# Altium schematic sheet TPS61023_Boost_Converter.SchDoc: TPS61023 Boost Converter
size A4
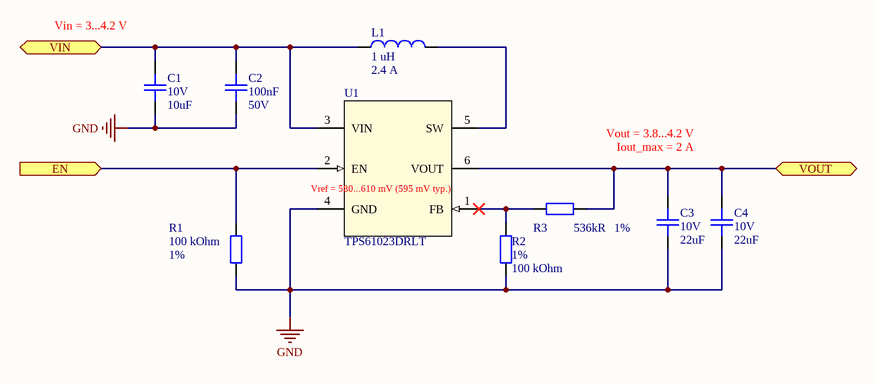
[diagram p0: TPS61023_Boost_Converter.SchDoc]

## Parts
C1  Voltage Rating: 10V  Capacitance: 10uF  [C0805]  (hidden comment: CAP CER 10uF X7R 10% 0805)
C2  Capacitance: 100nF  Voltage: 50V  [C0402]  (hidden comment: CAP CER 0.1UF 50V X7R 0402)
C3  Voltage Rating: 10V  Capacitance: 22uF  [C0805]  (hidden comment: CAP CER 22UF 10V X5R 0805)
C4  Voltage Rating: 10V  Capacitance: 22uF  [C0805]  (hidden comment: CAP CER 22UF 10V X5R 0805)
L1  Inductance: 1 uH  Maximum DC Current: 2.4 A  [IND_WE_LQSH_3012]  (hidden comment: FIXED IND 1UH 2.4A 54 MOHM MAX)
R1  Tolerance: 1%  Resistance: 100 kOhm  [R0402]  (hidden comment: RES SMD 100K OHM 1% 1/16W 0402)
R2  Tolerance: 1%  Resistance: 100 kOhm  [R0402]  (hidden comment: RES SMD 100K OHM 1% 1/16W 0402)
R3  Resistance: 536kR  Tolerance: 1%  [R0402]  (hidden comment: RES SMD 536K OHM 1% 1/16W 0402)
U1  TPS61023DRLT  [SOT50P160X60-6N]

## Ports
EN (in), VIN, VOUT

## Nets
GND: C1.2 C2.2 C3.1 C4.1 R1.1 R2.1 U1.4(GND)
EN: R1.2 U1.2(EN) ; port EN
VIN: C1.1 C2.1 L1.1 U1.3(VIN) ; port VIN
VOUT: C3.2 C4.2 R3.2 U1.6(VOUT) ; port VOUT
NetL1_2: L1.2 U1.5(SW)
NetR2_2: R2.2 R3.1 U1.1(FB)

## Notes on the sheet
- Vin = 3...4.2 V
- (near U1) Vref = 580...610 mV (595 mV typ.)
- Vout = 3.8...4.2 V
- Iout_max = 2 A
- Title
- Size:
- Date:
- A4
- Number:
- Time:
- Revision:
- Sheet
- of
- File:

## Library data of the parts
C1 = CAP CER 10uF X7R 10% 0805: Capacitor,10uF,10V,X7R,10%,0805,Murata; Manufacturer Part Number: GRM21BR71A106KA73L; Supplier 1: Digi-Key; Manufacturer: Murata; Stock 1: 2099435; Pricing 1: 1=0.26, 10=0.176, 100=0.089, 500=0.0609, 1000=0.0538 (USD); Mount: Surface Mount; Case Code (Metric): 2012; Case Code (Imperial): 0805; Min Operating Temperature: -55°C; Max Operating Temperature: 125°C; Packaging: Tape and Reel; Tolerance: 10%; Voltage Rating (DC): 10V; Dielectric: X7R; Termination: SMD/SMT; Package Quantity: 3000; Length: 2mm; Height: 1.25mm; Width: 1.25mm; Thickness: 0.055inch; Depth: 1.25mm; REACH SVHC: No SVHC; ComponentLink1URL: http://components.arrow.com/part/dataview/0323_07281730?src-supplier=Arrow+Europe; ComponentLink1Description: http://components.arrow.com/part/dataview/0323_07281730?src-supplier=Arrow+Europe; ComponentLink2URL: http://www.mouser.com/ds/2/281/c02e-2905.pdf?src-supplier=Mouser; ComponentLink2Description: http://www.mouser.com/ds/2/281/c02e-2905.pdf?src-supplier=Mouser; ComponentLink3URL: http://www.farnell.com/datasheets/2079188.pdf?src-supplier=Newark; ComponentLink3Description: http://www.farnell.com/datasheets/2079188.pdf?src-supplier=Newark; ComponentLink4URL: http://www.farnell.com/datasheets/2079188.pdf?src-supplier=Farnell; ComponentLink4Description: http://www.farnell.com/datasheets/2079188.pdf?src-supplier=Farnell; ComponentLink5URL: http://www.farnell.com/datasheets/2079188.pdf?src-supplier=Element14; ComponentLink5Description: http://www.farnell.com/datasheets/2079188.pdf?src-supplier=Element14; Supplier Part Number 1: 490-10516-1-ND; Case/Package: 0805; Weight: 0.000335oz; ComponentLink6URL: http://search.murata.co.jp/Ceramy/image/img/A01X/G101/ENG/GRM21BR71A106KA73-01.pdf?src-supplier=Digi-Key; ComponentLink6Description: http://search.murata.co.jp/Ceramy/image/img/A01X/G101/ENG/GRM21BR71A106KA73-01.pdf?src-supplier=Digi-Key
C2 = CAP CER 0.1UF 50V X7R 0402: 0.1µF ±10% 50V Ceramic Capacitor X7R 0402 (1005 Metric); Manufacturer: TDK; Manufacturer Part Number: CGA2B3X7R1H104K050BB; Supplier 1: Digi-Key; Stock 1: 2925303; Pricing 1: 1=0.17, 10=0.118, 50=0.0668, 100=0.0553, 500=0.0388, 1000=0.0321, 2500=0.0299, 5000=0.0273 (USD); Mount: Surface Mount; Case Code (Metric): 1005; Case Code (Imperial): 0402; Min Operating Temperature: -55°C; Max Operating Temperature: 125°C; Packaging: Tape and Reel; Tolerance: 10%; Voltage Rating (DC): 50V; Dielectric: X7R; Termination: SMD/SMT; Package Quantity: 1; Length: 1mm; Height: 0.5mm; Width: 0.02inch; Thickness: 0.022inch; Depth: 0.5mm; REACH SVHC: No SVHC; ComponentLink1URL: http://product.tdk.com/capacitor/mlcc/en/documents/mlccspec_automotive_general_midvoltage_en.pdf?src-supplier=Future+Electronics; ComponentLink1Description: http://product.tdk.com/capacitor/mlcc/en/documents/mlccspec_automotive_general_midvoltage_en.pdf?src-supplier=Future+Electronics; ComponentLink2URL: http://www.farnell.com/datasheets/1807242.pdf?src-supplier=Element14; ComponentLink2Description: http://www.farnell.com/datasheets/1807242.pdf?src-supplier=Element14; ComponentLink3URL: http://www.mouser.com/ds/2/400/lcc_automotive_general_en-843974.pdf?src-supplier=Mouser; ComponentLink3Description: http://www.mouser.com/ds/2/400/lcc_automotive_general_en-843974.pdf?src-supplier=Mouser; ComponentLink4URL: http://www.farnell.com/datasheets/1936565.pdf?src-supplier=Element14; ComponentLink4Description: http://www.farnell.com/datasheets/1936565.pdf?src-supplier=Element14; ComponentLink5URL: http://www.farnell.com/datasheets/1735392.pdf?src-supplier=Element14; ComponentLink5Description: http://www.farnell.com/datasheets/1735392.pdf?src-supplier=Element14; Supplier Part Number 1: 445-6899-1-ND; Case/Package: 0402; Voltage Rating: 50V; Weight: 2.3E-05oz; Composition: Ceramic; Ratings: AEC-Q200; Lead Free: Lead Free
C3 C4 = CAP CER 22UF 10V X5R 0805: 22µF ±20% 10V Ceramic Capacitor X5R 0805 (2012 Metric); Manufacturer: Taiyo Yuden; Manufacturer Part Number: LMK212BJ226MG-T; Supplier 1: Digi-Key; Stock 1: 1006805; Pricing 1: 1=0.45, 10=0.312, 100=0.1875, 500=0.1406, 1000=0.1187 (USD); Mount: Surface Mount; Number of Pins: 2; Case Code (Metric): 2012; Case Code (Imperial): 0805; Min Operating Temperature: -55°C; Max Operating Temperature: 85°C; Packaging: Tape and Reel; Tolerance: 20%; Voltage Rating (DC): 10V; Dielectric: X5R; Termination: SMD/SMT; Package Quantity: 1; Composition: Ceramic; Length: 2mm; Height: 1.25mm; Width: 0.049inch; Thickness: 0.053inch; Depth: 1.25mm; Radiation Hardening: No; REACH SVHC: Unknown; ComponentLink1URL: https://www.yuden.co.jp/productdata/catalog/mlcc_all_e.pdf?src-supplier=Onlinecomponents.com; ComponentLink1Description: https://www.yuden.co.jp/productdata/catalog/mlcc_all_e.pdf?src-supplier=Onlinecomponents.com; ComponentLink2URL: https://www.yuden.co.jp/productdata/catalog/mlcc01_e.pdf?src-supplier=Digi-Key; ComponentLink2Description: https://www.yuden.co.jp/productdata/catalog/mlcc01_e.pdf?src-supplier=Digi-Key; ComponentLink3URL: https://www.yuden.co.jp/productdata/catalog/mlcc_all_e.pdf?src-supplier=Mouser; ComponentLink3Description: https://www.yuden.co.jp/productdata/catalog/mlcc_all_e.pdf?src-supplier=Mouser; ComponentLink4URL: http://www.farnell.com/datasheets/1910934.pdf?src-supplier=Element14; ComponentLink4Description: http://www.farnell.com/datasheets/1910934.pdf?src-supplier=Element14; ComponentLink5URL: https://www.yuden.co.jp/productdata/catalog/mlcc_all_e.pdf?src-supplier=Avnet; ComponentLink5Description: https://www.yuden.co.jp/productdata/catalog/mlcc_all_e.pdf?src-supplier=Avnet; Supplier Part Number 1: 587-1958-1-ND; Case/Package: 0805
L1 = FIXED IND 1UH 2.4A 54 MOHM MAX: 1µH Semi-Shielded Wirewound Inductor 2.4A 54mOhm Max Nonstandard; Manufacturer: Wurth Elektronik; Manufacturer Part Number: 74405031010; Maximum DC Resistance: 54 mOhms; Self Resonant Frequency: 66 MHz; Tolerance: 20 %; Saturation Current: 5.4 A; Test Frequency: 1 MHz; Supplier 1: Mouser; RoHS: RoHS Compliant; Category: Fixed Inductors; Stock 1: 2000; Pricing 1: 1=0.730, 10=0.721, 50=0.601, 100=0.457, 1000=0.397, 2000=0.385 (USD); Application: Power; Height: 1.2 mm; Length: 3 mm; Package / Case: 3 mm x 3 mm; Packaging: Cut Tape; Product: Fixed Inductors; Series: WE-LQSH; Shielding: Shielded; Termination Style: SMD/SMT; Width: 3 mm; Brand: Wurth Elektronik; Mounting Style: PCB Mount; Maximum Operating Temperature: + 125 C; Minimum Operating Temperature: - 40 C; Product Type: Fixed Inductors; Standard Pack Qty: 2000; Subcategory: Inductors, Chokes & Coils; Termination: -; RoHS - Mouser: Y; Minimum Order Quantity: 1; Reeling: True; ComponentLink1URL: https://www.mouser.com/datasheet/2/445/74405031010-1720907.pdf; ComponentLink1Description: https://www.mouser.com/datasheet/2/445/74405031010-1720907.pdf; Supplier 2: Digi-Key; Supplier Part Number 1: 710-74405031010; Supplier Part Number 2: 732-10780-1-ND; Mount: Surface Mount
R1 R2 = RES SMD 100K OHM 1% 1/16W 0402: 100 kOhms ±1% 0.063W, 1/16W Chip Resistor 0402 (1005 Metric) Moisture Resistant Thick Film; Manufacturer: Yageo; Manufacturer Part Number: RC0402FR-07100KL; Temperature Coefficient: 100ppm/°C; Power Rating: 63mW; Voltage Rating: 50V; Supplier 1: Digi-Key; Stock 1: 47448883; Pricing 1: 1=0.1, 10=0.016, 100=0.0064, 1000=0.0029, 2500=0.0025, 5000=0.0021 (USD); Case Code (Metric): 1005; Case Code (Imperial): 0402; Min Operating Temperature: -55°C; Max Operating Temperature: 155°C; Composition: Thick Film; Packaging: Tape and Reel; Package Quantity: 1; Number of Terminations: 2; Termination: SMD/SMT; Military Standard: Not; Max Power Dissipation: 63mW; Working Voltage: 50V; Features: Moisture Resistant; Length: 0.039inch; Height: 0.016inch; Width: 0.02inch; Depth: 0.5mm; REACH SVHC: No SVHC; Lead Free: Lead Free; ComponentLink1URL: http://www.yageo.com/documents/recent/PYu-RC_Group_51_RoHS_L_10.pdf?src-supplier=Digi-Key; ComponentLink1Description: http://www.yageo.com/documents/recent/PYu-RC_Group_51_RoHS_L_10.pdf?src-supplier=Digi-Key; ComponentLink2URL: http://www.farnell.com/datasheets/1018594.pdf?src-supplier=Element14; ComponentLink2Description: http://www.farnell.com/datasheets/1018594.pdf?src-supplier=Element14; ComponentLink3URL: http://www.yageo.com/documents/recent/PYu-RC_Group_51_RoHS_L_9.pdf?src-supplier=Verical; ComponentLink3Description: http://www.yageo.com/documents/recent/PYu-RC_Group_51_RoHS_L_9.pdf?src-supplier=Verical; ComponentLink4URL: http://www.yageo.com/documents/recent/PYu-RC_Group_51_RoHS_L_9.pdf?src-supplier=Mouser; ComponentLink4Description: http://www.yageo.com/documents/recent/PYu-RC_Group_51_RoHS_L_9.pdf?src-supplier=Mouser; ComponentLink5URL: http://documents.rs-components.com/techlib://itc_doclist_GB.htm?stockno=6185797&src-supplier=RSComponents; ComponentLink5Description: http://documents.rs-components.com/techlib://itc_doclist_GB.htm?stockno=6185797&src-supplier=RSComponents; Supplier Part Number 1: 311-100KLRDKR-ND; Case/Package: 0402; Mount: Surface Mount
R3 = RES SMD 536K OHM 1% 1/16W 0402: 536 kOhms ±1% 0.063W, 1/16W Chip Resistor 0402 (1005 Metric) Moisture Resistant Thick Film; Manufacturer: Yageo; Manufacturer Part Number: RC0402FR-07536KL; Power Rating: 62.5mW; Voltage Rating: 50V; Temperature Coefficient: 100ppm/°C; Max Power Dissipation: 63mW; Supplier 1: Digi-Key; Stock 1: 16630; Pricing 1: 1=0.1, 10=0.015, 100=0.0062, 1000=0.0028, 2500=0.0024, 5000=0.002 (USD); Case/Package: 0402; Case Code (Imperial): 0402; Case Code (Metric): 1005; Min Operating Temperature: -55°C; Max Operating Temperature: 155°C; Packaging: Tape and Reel; Termination: SMD/SMT; Composition: Thick Film; Number of Terminations: 2; Military Standard: Not; Features: Moisture Resistant; Length: 1mm; Height: 0.016inch; Depth: 0.5mm; Width: 0.02inch; Lead Free: Lead Free; ComponentLink1URL: http://www.yageo.com/documents/recent/PYu-RC0402_51_RoHS_L_6.pdf?src-supplier=Avnet+Europe; ComponentLink1Description: http://www.yageo.com/documents/recent/PYu-RC0402_51_RoHS_L_6.pdf?src-supplier=Avnet+Europe; ComponentLink2URL: http://www.mouser.com/ds/2/447/PYu-RC0402_51_RoHS_L_6_r-8721.pdf?src-supplier=Mouser; ComponentLink2Description: http://www.mouser.com/ds/2/447/PYu-RC0402_51_RoHS_L_6_r-8721.pdf?src-supplier=Mouser; ComponentLink3URL: http://www.yageo.com/documents/recent/PYu-RC0402_51_RoHS_L_6_r.pdf?src-supplier=Future+Electronics; ComponentLink3Description: http://www.yageo.com/documents/recent/PYu-RC0402_51_RoHS_L_6_r.pdf?src-supplier=Future+Electronics; ComponentLink4URL: http://www.yageo.com/documents/recent/PYu-RC0402_51_RoHS_L_6.pdf?src-supplier=Avnet; ComponentLink4Description: http://www.yageo.com/documents/recent/PYu-RC0402_51_RoHS_L_6.pdf?src-supplier=Avnet; Supplier Part Number 1: YAG3181CT-ND; Contact Plating: Tin,Matte; Mount: Surface Mount
U1 = IC TPS61023DRLT REG BOOST ADJ 3A SOT563: Boost Switching Regulator IC Positive Adjustable 2.2V 1 Output 3A SOT-563, SOT-666; Manufacturer: Texas Instruments; Input Voltage: 0.5 V to 5.5 V; Input Voltage MAX: 5.5 V; Output Current: 3.7 A; Output Voltage: 2.2 V to 5.5 V; Quiescent Current: 0.9 uA; Switching Frequency: 1 MHz; Development Kit: TPS61023EVM-052; Input Voltage MIN: 0.5 V; Product Status: New Product; Supplier 1: Mouser; Manufacturer Part Number: TPS61023DRLT; RoHS: RoHS Compliant; Category: Switching Voltage Regulators; Stock 1: 196; Pricing 1: 1=1.07, 10=0.902, 100=0.693, 250=0.612, 500=0.580, 1000=0.451, 2500=0.429, 5000=0.413, 10000=0.400 (USD); Height: 0.55 mm; Length: 1.6 mm; Number of Outputs: 1 Output; Package / Case: SOT-5X3-6; Packaging: Cut Tape; Series: TPS61023; Width: 1.2 mm; Brand: Texas Instruments; Mounting Style: SMD/SMT; Shutdown: Shutdown; Topology: Boost; Maximum Operating Temperature: + 125 C; Minimum Operating Temperature: - 40 C; Product Type: Switching Voltage Regulators; Standard Pack Qty: 250; Subcategory: PMIC - Power Management ICs; Supply Voltage - Min: 0.5 V; RoHS - Mouser: Y; Minimum Order Quantity: 1; Reeling: True; Supplier 2: Digi-Key; Supplier Part Number 1: 595-TPS61023DRLT; Supplier Part Number 2: 296-TPS61023DRLTCT-ND; Mount: Surface Mount